# EAGLE design MakerstudioTrainingBoard (EAGLE 8.7.1)
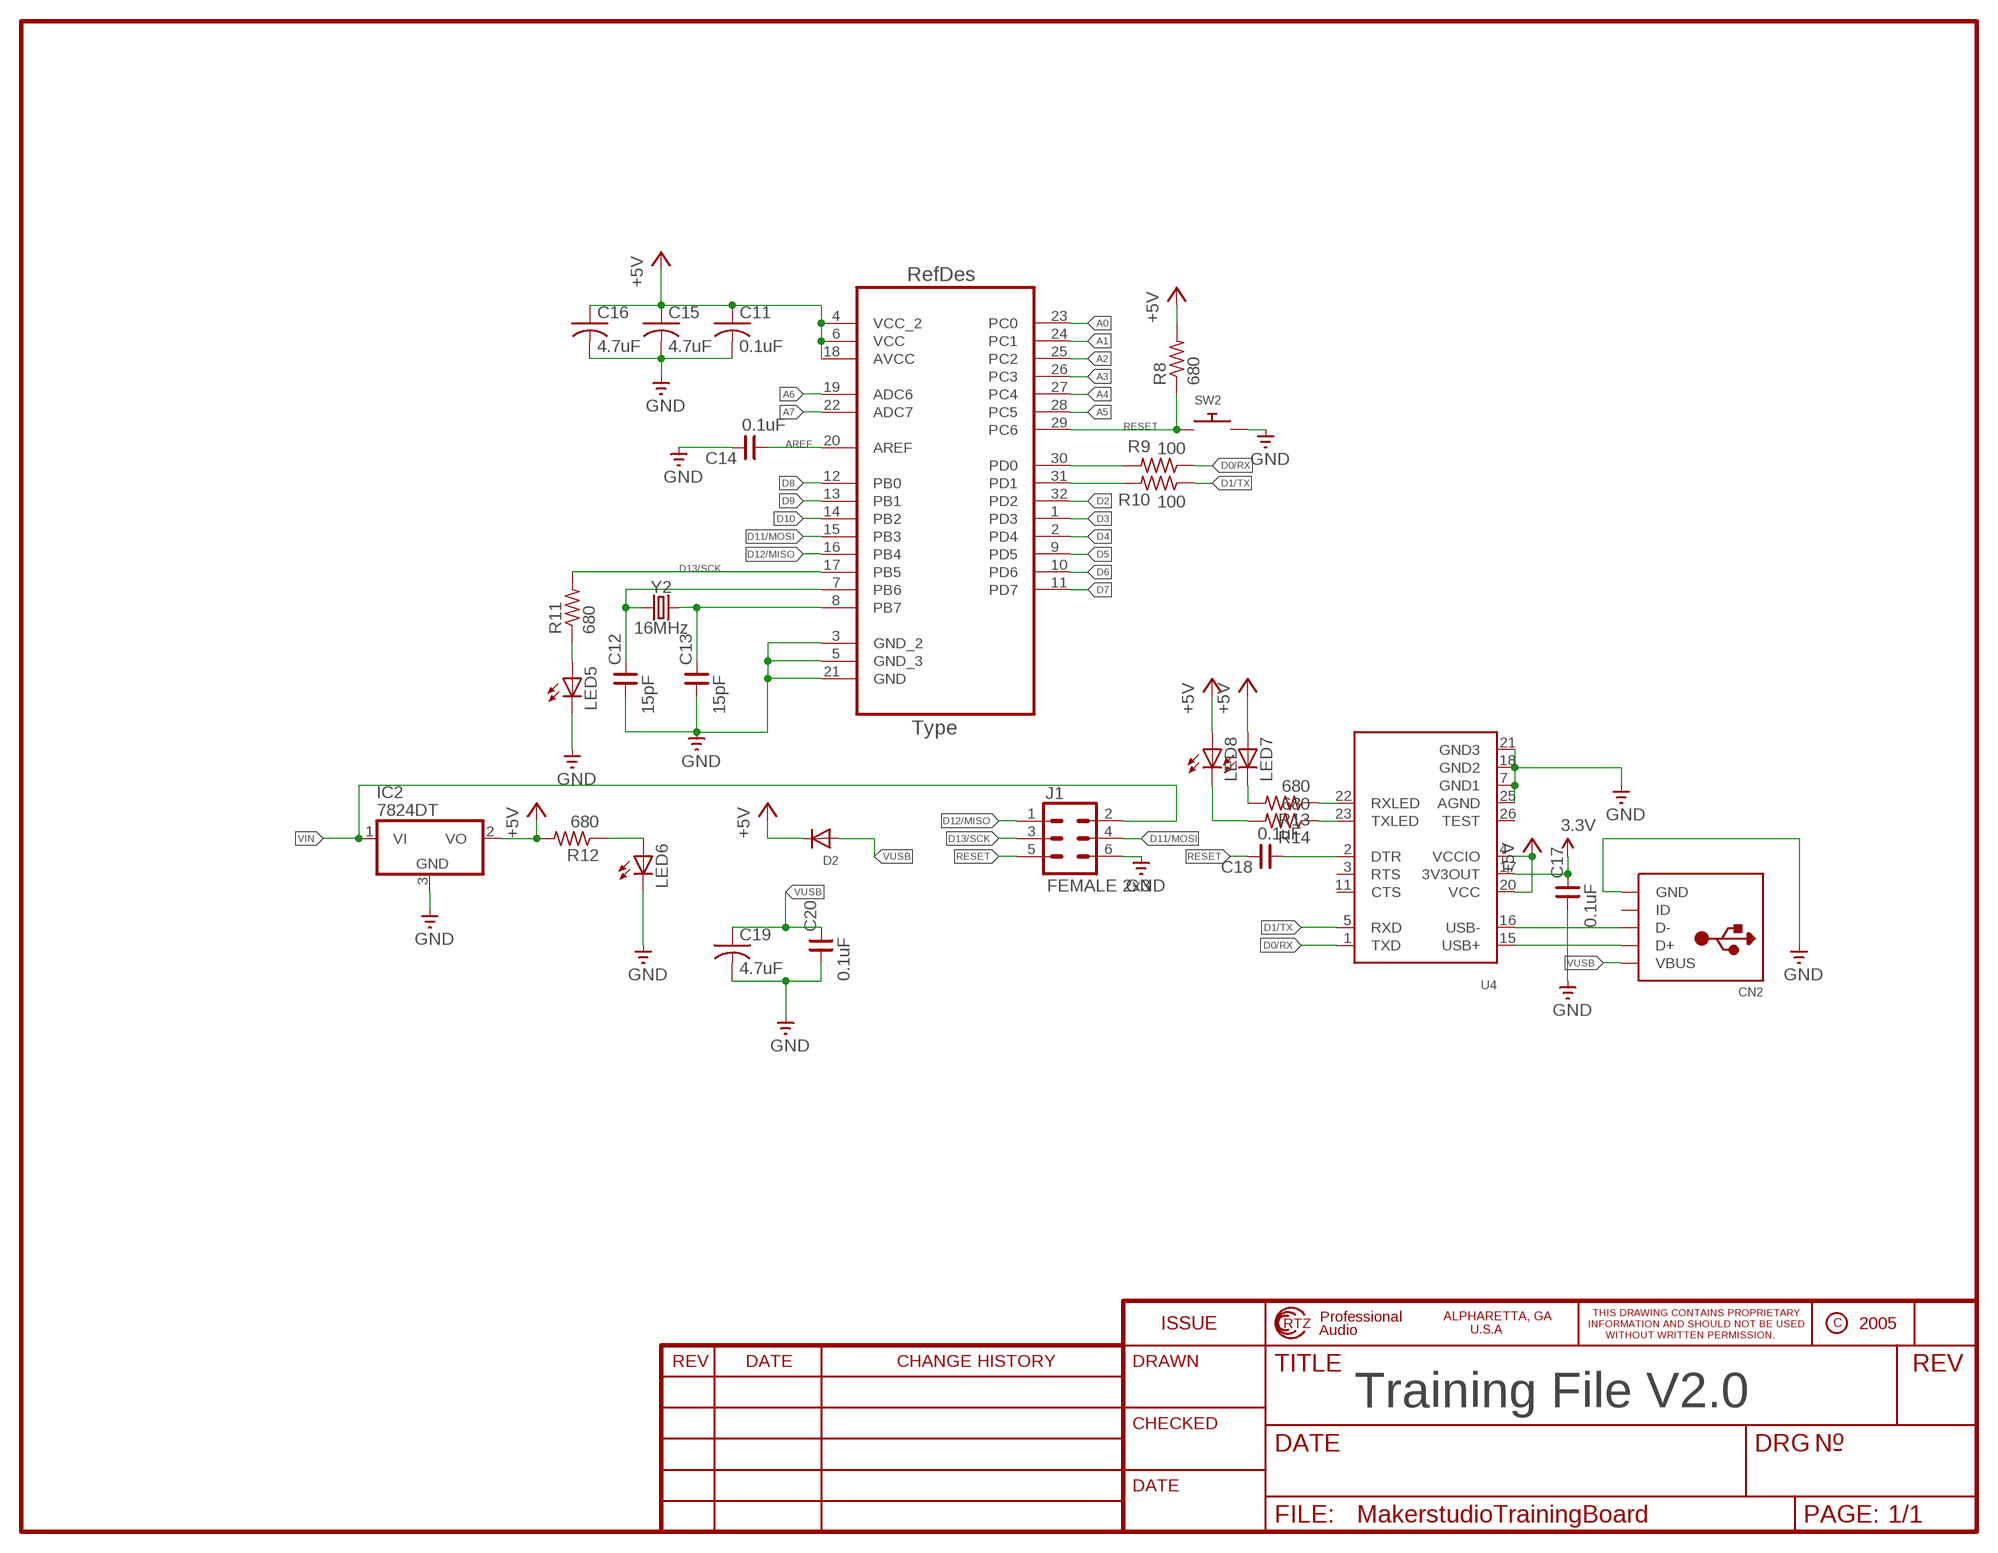
[diagram p0: schematic, sheet 1]

## Parts
C11  0.1uF  C-USC0805  [C0805]
C12  15pF  CNP-0805  [0805]
C13  15pF  CNP-0805  [0805]
C14  0.1uF  CNP-0805  [0805]
C15  4.7uF  C-USC0805  [C0805]
C16  4.7uF  C-USC0805  [C0805]
C17  0.1uF  CNP-0805  [0805]
C18  0.1uF  CNP-0805  [0805]
C19  4.7uF  C-USC0805  [C0805]
C20  0.1uF  CNP-0805  [0805]
CN2  USBMINIB  [USB-MINIB]
D2  DIODESOD-123  [SOD-123]
IC2  7824DT  [TO252]
J1  FEMALE 2x3  CONN_03X2FEMALE  [2X3]
LED5  LEDCHIPLED_0805  [CHIPLED_0805]
LED6  LEDCHIPLED_0805  [CHIPLED_0805]
LED7  LEDCHIPLED_0805  [CHIPLED_0805]
LED8  LEDCHIPLED_0805  [CHIPLED_0805]
R8  680  R-US_R0805  [R0805]
R9  100  R-US_R0805  [R0805]
R10  100  R-US_R0805  [R0805]
R11  680  R-US_R0805  [R0805]
R12  680  R-US_R0805  [R0805]
R13  680  R-US_R0805  [R0805]
R14  680  R-US_R0805  [R0805]
SW2  SWITCH_PUSHBUTTONEVQ-PE  [TACT_PANA-EVQ]
U3  ATMEGA328P-AU  [QFP80P900X900X120-32N]
U4  FT232RLSSOP28  [SSOP28DB]
Y2  16MHz  CRYSTAL-16MHZPTH-HC49US  [HC49US]

## Nets
3.3V: C17.2 U4.17(3V3OUT)
+5V: C11.1 C15.1 C16.1 D2.C IC2.2(VO) LED7.A LED8.A R8.2 R12.2 U3.4(VCC_2) U3.6(VCC) U3.18(AVCC) U4.4(VCCIO) U4.20(VCC)
A0: U3.23(PC0)
A1: U3.24(PC1)
A2: U3.25(PC2)
A3: U3.26(PC3)
A4: U3.27(PC4)
A5: U3.28(PC5)
A6: U3.19(ADC6)
A7: U3.22(ADC7)
AREF: C14.1 U3.20(AREF)
D0/RX: R9.1 U4.1(TXD)
D1/TX: R10.1 U4.5(RXD)
D2: U3.32(PD2)
D3: U3.1(PD3)
D4: U3.2(PD4)
D5: U3.9(PD5)
D6: U3.10(PD6)
D7: U3.11(PD7)
D8: U3.12(PB0)
D9: U3.13(PB1)
D10: U3.14(PB2)
D11/MOSI: J1.4 U3.15(PB3)
D12/MISO: J1.1 U3.16(PB4)
D13/SCK: J1.3 R11.2 U3.17(PB5)
GND: C11.2 C12.1 C13.1 C14.2 C15.2 C16.2 C17.1 C19.2 C20.1 CN2.GND IC2.3(GND) J1.6 LED5.C LED6.C SW2.P$2 U3.3(GND_2) U3.5(GND_3) U3.21(GND) U4.7(GND1) U4.18(GND2) U4.21(GND3) U4.25(AGND)
N$1: LED5.A R11.1
N$112: C13.2 U3.8(PB7) Y2.2
N$113: C12.2 U3.7(PB6) Y2.1
N$114: R9.2 U3.30(PD0)
N$115: R10.2 U3.31(PD1)
N$117: LED6.A R12.1
N$118: CN2.D+ U4.15(USB+)
N$119: CN2.D- U4.16(USB-)
N$120: R13.1 U4.22(RXLED)
N$121: R14.1 U4.23(TXLED)
N$122: LED8.C R14.2
N$123: LED7.C R13.2
N$124: C18.1 U4.2(DTR)
RESET: C18.2 J1.5 R8.1 SW2.P$1 U3.29(PC6)
VIN: IC2.1(VI) J1.2
VUSB: C19.1 C20.2 CN2.VBUS D2.A
Unconnected: CN2.ID U4.3(RTS) U4.11(CTS) U4.26(TEST)

## Notes on the sheet
- Training File V2.0

## Library data of the parts
C11 C15 C16 C19 = adafruit:C-US: CAPACITOR, American symbol
C12-C14 C17 C18 C20 = cap-master:CNP-: NON-POLARIZED CAP
CN2 = adafruit:USB: USB Connectors USBMINIB - Surface Mount Female Mini-B USB Connector 4UConnector: 06564 By microbuilder.eu Thru-hole RA Female Mini-B USB Connector 4UConnector: 18732 By ladyada.net
D2 = adafruit:DIODE: Diode SMADIODE - SMA Surface Mount Package 20V 1A Schottky Diode Digikey: 641-1014-6-ND DO-1N4148 - Through Hole Small Current Diode SOD-123 20V 1 A (.5mV Vf) Schottky Diode - Digikey: MBRX120TPMSCT-ND SOD-323 10V 570mA (.38mV Vf, 3ns) Schottky Diode - Digikey: ZLLS410CT-ND SOD-523 30V 30mA Schottky Diode (RB751S-40TE61) - Digikey: RB751S-40TE61CT-ND SOT23-R/W - SOT23 Package (R = Solder Paste/Reflow Ovens, W = Hand-Soldering) BAT54Film 40V 300mA - Digikey: 497-7162-1-ND
IC2 = adafruit:78*: Positive VOLTAGE REGULATOR Added bigger pads to the TO-92 package
J1 = SparkFun-Connectors:CONN_03X2: Multi connection point. Often used as Generic Header-pin footprint for 0.1 inch spaced/style header connections You can populate with any combo of single row headers, but if you'd like an exact match, check these: Header - 2x3 (Male, 0.1") <https://www.sparkfun.com/products/12807> (PRT-12807) Header - 2x3 (Female, 0.1") <https://www.sparkfun.com/products/13010> (PRT-13010) 2x3 Pin Shrouded Header <https://www.sparkfun.com/products/10877> (PRT-10877) On any of the 0.1 inch spaced packages, you can populate with these: Break Away Headers - Straight <https://www.sparkfun.com/products/116> (PRT-00116) Break Away Male Headers - Right Angle <https://www.sparkfun.com/products/553> (PRT-00553) Female Headers <https://www.sparkfun.com/products/115> (PRT-00115) Break Away Headers - Machine Pin <https://www.sparkfun.com/products/117> (PRT-00117) Break Away Female Headers - Swiss Machine Pin <https://www.sparkfun.com/products/743> (PRT-00743) Special note: the shrouded connector mates well with our 3x2 ribbon cables: Ribbon Crimp Connector - 6-pin (2x3, Female) <https://www.sparkfun.com/products/10651> (PRT-10651) Ribbon Cable - 6 wire (15ft) <https://www.sparkfun.com/products/10646> (PRT-10646); PROD_ID: CONN-11566
LED5-LED8 = adafruit:LED: LED OSRAM: - CHIPLED LG R971, LG N971, LY N971, LG Q971, LY Q971, LO R971, LY R971 LH N974, LH R974 LS Q976, LO Q976, LY Q976 LO Q996 - Hyper CHIPLED LW Q18S LB Q993, LB Q99A, LB R99A - SideLED LS A670, LO A670, LY A670, LG A670, LP A670 LB A673, LV A673, LT A673, LW A673 LH A674 LY A675 LS A676, LA A676, LO A676, LY A676, LW A676 LS A679, LY A679, LG A679 - Hyper Micro SIDELED® LS Y876, LA Y876, LO Y876, LY Y876 LT Y87S - SmartLED LW L88C, LW L88S LB L89C, LB L89S, LG L890 LS L89K, LO L89K, LY L89K LS L896, LA L896, LO L896, LY L896 - TOPLED LS T670, LO T670, LY T670, LG T670, LP T670 LSG T670, LSP T670, LSY T670, LOP T670, LYG T670 LG T671, LOG T671, LSG T671 LB T673, LV T673, LT T673, LW T673 LH T674 LS T676, LA T676, LO T676, LY T676, LB T676, LH T676, LSB T676, LW T676 LB T67C, LV T67C, LT T67C, LS T67K, LO T67K, LY T67K, LW E67C LS E67B, LA E67B, LO E67B, LY E67B, LB E67C, LV E67C, LT E67C LW T67C LS T679, LY T679, LG T679 LS T770, LO T770, LY T770, LG T770, LP T770 LB T773, LV T773, LT T773, LW T773 LH T774 LS E675, LA E675, LY E675, LS T675 LS T776, LA T776, LO T776, LY T776, LB T776 LHGB T686 LT T68C, LB T68C - Hyper Mini TOPLED® LB M676 - Mini TOPLED Santana® LG M470 LS M47K, LO M47K, LY M47K Source: http://www.osram.convergy.de/
R8-R14 = adafruit:R-US_: RESISTOR, American symbol
SW2 = adafruit:SWITCH_PUSHBUTTON: Buttons SOFTTOUCHSMD_SJ - Soft touch temporary push button (Super Junk Akihabara) Compatible with SKPMANE010 [Mouser: 688-SKPMAN] C&K_KSS = Digikey: KSS221GLFS
U3 = Atmel-ATMEGA328P-AU:ATMEGA328P-AU; DESCRIPTION: 8-bit Microcontroller with In-System Programmable Flash; MPN: ATMEGA328P-AU; OC_FARNELL: 1715486; OC_NEWARK: 14R4631; PACKAGE: TQFP-32; SUPPLIER: Atmel
U4 = microbuilder:FT232RL: FTDI FT232RL USB TO RS232 Converter Digikey: 768-1007-1-ND
Y2 = SparkFun-Clocks:CRYSTAL-16MHZ: 16MHz Crystal Digikey Example <http://www.digikey.com/product-search/en?keywords=535-9122-1-ND> Frequency: 16MHz Frequency Stability: ±50ppm Frequency Tolerance: ±20ppm Load Capacitance: 18pF SparkFun Products: Pro Micro -5V/16MHz <https://www.sparkfun.com/products/12640> SparkFun Serial Enabled LCD Kit <https://www.sparkfun.com/products/10097>; PROD_ID: XTAL-08181; SF_ID: COM-00536

## Net classes
0 default: width 0.305 mm

## Board
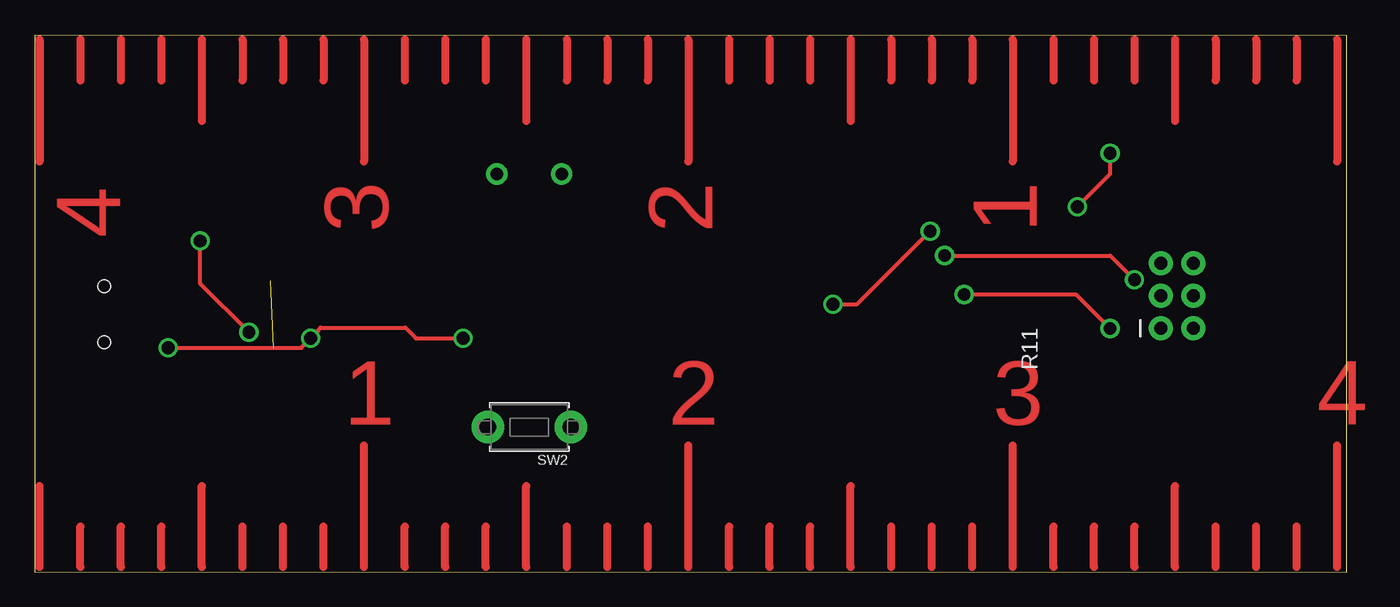
[diagram p1: board, top side]
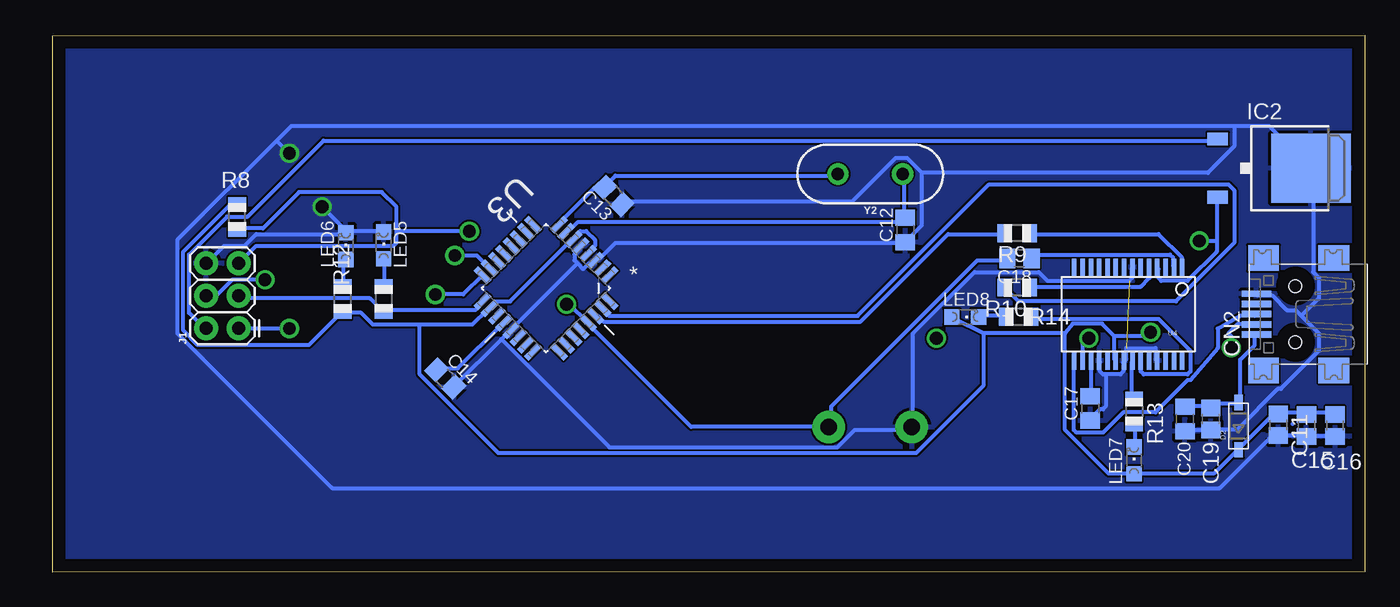
[diagram p2: board, bottom side, seen from below]

Size 102.72 x 42.02 mm. Coordinates in mm from the lower left corner, seen from the top.
Outline: 0,0.03 102.72,0 102.72,41.99 0,42.02 0,0.03
Copper layers (1*16): Top 0.035mm / dielectric 1.5mm / Bottom 0.035mm
Design rules "default": minimum track width 6mil, minimum drill 0.35mm, track to track 6mil, track to pad 6mil, pad to pad 6mil, via to via 6mil, smd to smd 6mil, copper to edge 40mil, drill to drill 6mil, minimum pad ring 10mil, minimum via ring 8mil, stop-mask expansion 4mil, vias tented up to drill 0mil, thermal gap 10mil

### Footprints (pad centres in the part's own frame; a part is rotated, then mirrored left to right if it is on the bottom)
C0805 = smd 1.3 x 1.5: 1 -0.85,0; 2 0.85,0
0805 = smd 1.27 x 1.524: 1 -0.953,0; 2 0.953,0
USB-MINIB = smd 0.5 x 2.308: D+ 0,4.064; D- -0.8,4.064; GND 1.6,4.064; ID 0.8,4.064; VBUS -1.6,4.064 | smd 2 x 2.4: GND1 -4.4,-2; GND2 -4.4,3.5; GND3 4.4,3.5; GND4 4.4,-2 | hole 1: -2.2,1; 2.2,1
SOD-123 = smd 1.2 x 0.7: A 1.85,0; C -1.85,0
TO252 = smd 1 x 1.6: 1 -2.28,-4.8; 2 2.28,-4.8 | smd 5.4 x 6.2: 3 0,2.5
2X3 = drill 1.016 pad 1.88: 1 0,0; 2 0,2.54; 3 2.54,0; 4 2.54,2.54; 5 5.08,0; 6 5.08,2.54
CHIPLED_0805 = smd 1.2 x 1.2: A 0,-1.05; C 0,1.05
R0805 = smd 1.1 x 1.4: 1 -1,0; 2 1,0
TACT_PANA-EVQ = drill 1.3 pad 2.54: P$1 -3.25,0; P$2 3.25,0
QFP80P900X900X120-32N = smd 1.473 x 0.508: 1 -4.242,2.794; 2 -4.242,2.007; 3 -4.242,1.194; 4 -4.242,0.406; 5 -4.242,-0.406; 6 -4.242,-1.194; 7 -4.242,-2.007; 8 -4.242,-2.794; 17 4.242,-2.794; 18 4.242,-2.007; 19 4.242,-1.194; 20 4.242,-0.406; 21 4.242,0.406; 22 4.242,1.194; 23 4.242,2.007; 24 4.242,2.794 | smd 0.508 x 1.473: 9 -2.794,-4.242; 10 -2.007,-4.242; 11 -1.194,-4.242; 12 -0.406,-4.242; 13 0.406,-4.242; 14 1.194,-4.242; 15 2.007,-4.242; 16 2.794,-4.242; 25 2.794,4.242; 26 2.007,4.242; 27 1.194,4.242; 28 0.406,4.242; 29 -0.406,4.242; 30 -1.194,4.242; 31 -2.007,4.242; 32 -2.794,4.242
SSOP28DB = smd 0.348 x 1.397: 1 -4.225,-3.656; 2 -3.575,-3.656; 3 -2.925,-3.656; 4 -2.275,-3.656; 5 -1.625,-3.656; 6 -0.975,-3.656; 7 -0.325,-3.656; 8 0.325,-3.656; 9 0.975,-3.656; 10 1.625,-3.656; 11 2.275,-3.656; 12 2.925,-3.656; 13 3.575,-3.656; 14 4.225,-3.656; 15 4.225,3.656; 16 3.575,3.656; 17 2.925,3.656; 18 2.275,3.656; 19 1.625,3.656; 20 0.975,3.656; 21 0.325,3.656; 22 -0.325,3.656; 23 -0.975,3.656; 24 -1.625,3.656; 25 -2.275,3.656; 26 -2.925,3.656; 27 -3.575,3.656; 28 -4.225,3.656
HC49US = drill 1 pad 1.651: 1 -2.54,0; 2 2.54,0

### Placement (x,y rotation side)
C11  6.76,11.55 270 bottom
C12  35.96,26.8 90 bottom
C13  58.82,29.46 135 bottom
C14  71.99,15.17 315 bottom
C15  4.55,11.49 270 bottom
C16  2.32,11.49 270 bottom
C17  21.48,12.83 90 bottom
C18  27.03,24.57 180 bottom
C19  12.04,12 270 bottom
C20  14.08,12 90 bottom
CN2  4.41,20.2 90 bottom
D2  9.88,11.44 90 bottom
IC2  6.7,31.63 270 bottom
J1  88.17,19.1 90 bottom
LED5  76.81,25.59 0 bottom
LED6  79.78,25.53 0 bottom
LED7  18.05,8.76 0 bottom
LED8  31.27,19.99 270 bottom
R8  88.29,27.81 90 bottom
R9  27.2,26.54 180 bottom
R10  27.2,22.29 180 bottom
R11  76.81,21.4 270 bottom
R12  80.04,21.39 270 bottom
R13  18.05,12.57 270 bottom
R14  27.08,19.99 180 bottom
SW2  38.71,11.36 180 top
U3  64.1,22.24 225 bottom
U4  18.51,20.2 180 bottom
Y2  38.71,31.18 180 bottom

### Tracks (layer width: path | path; a pad name or v marks a point on that pad's centre or on a via)
3.3V
  Bottom 0.305: U4.17 21.41,16.41 21.41,13.9 C17.2
+5V  (via drill 1)
  Top 0.305: v16.76,18.79 12.95,22.6 v12.95,25.94
  Bottom 0.305: U3.4 60.73,25.1 60.27,25.56 60.27,26.01 60.96,26.7 61.42,26.7 61.87,26.24 U3.6 62.1,26.01 66.9,21.21 68.05,21.21 68.5,20.76 U3.18 68.73,20.53 69.87,19.39 73.99,19.39 | 73.99,19.39 77.65,19.39 78.56,20.3 79.93,20.3 R12.2 80.16,20.3 82.68,17.79 91.36,17.79 92.51,18.93 92.51,25.1 88.85,28.76 88.39,28.76 R8.2 | 29.87,18.7 32.16,19.84 LED8.A | 23.47,18.7 22.86,19.46 20.57,19.46 19.62,18.51 | 23.47,18.7 29.87,18.7 | 19.62,18.51 19.58,18.47 19.58,16.64 U4.20 | C16.1 2.44,12.53 4.5,12.53 C15.1 4.72,12.53 6.55,12.53 C11.1 6.78,12.3 7.24,12.3 9.75,9.78 D2.C 9.98,9.56 11.81,7.73 17.98,7.73 LED7.A 18.21,7.73 20.04,7.73 23.47,11.16 23.47,18.7 | 73.99,19.39 73.99,15.5 67.82,9.33 35.13,9.33 29.87,14.58 29.87,18.7 | 11.58,25.94 11.58,29.22 IC2.2 | 11.58,25.94 11.58,25.1 13.87,22.81 15.93,22.81 16.15,23.04 16.15,23.73 U4.4 | 19.62,18.51 17.04,18.51 v16.76,18.79 | v12.95,25.94 11.58,25.94
AREF
  Bottom 0.305: U3.20 67.59,19.39 71.02,15.96 72.62,15.96 C14.1
D0/RX
  Bottom 0.305: U4.1 14.33,23.96 14.33,24.64 16.15,26.47 25.98,26.47 R9.1
D1/TX
  Bottom 0.305: U4.5 16.84,23.73 16.84,23.04 17.53,22.36 25.98,22.36 R10.1
D11/MOSI  (via drill 1)
  Top 0.305: v71.25,24.8 84.2,24.8 v86.11,22.89
  Bottom 0.305: U3.15 69.5,24.8 v71.25,24.8 | v86.11,22.89 88.68,22.89 89.93,21.64 J1.4
D12/MISO  (via drill 1)
  Top 0.305: v72.77,21.75 81.53,21.75 v84.2,19.08
  Bottom 0.305: U3.16 70.59,21.75 v72.77,21.75 | v84.2,19.08 88.15,19.08 J1.1
D13/SCK
  Bottom 0.305: U3.17 69.19,20.99 69.65,20.53 76.73,20.53 R11.2 76.96,20.53 77.88,21.44 88.16,21.44 J1.3
GND  (via drill 1)  (1 unrouted)
  Top 0.305: v81.62,28.61 84.2,31.18 v84.2,32.8
  Bottom 0.305: U4.25 16.38,16.64 16.38,17.56 18.67,17.56 18.67,16.64 U4.21 18.9,16.41 18.9,15.73 19.13,15.5 20.27,15.5 | 20.27,15.5 20.5,15.5 20.73,15.73 20.73,16.41 U4.18 | 20.27,15.5 20.27,12.98 20.5,12.76 20.73,12.76 21.41,12.07 C17.1 | U4.7 18.21,23.73 18.21,23.04 18.44,22.81 24.84,22.81 25.53,23.5 30.56,23.5 35.36,18.7 35.36,11.38 SW2.P$2 35.58,11.16 39.93,11.16 41.3,9.78 59.13,9.78 67.59,18.24 | 67.59,18.24 71.25,14.58 C14.2 | 67.59,18.24 66.9,18.93 U3.21 66.67,19.16 61.65,24.19 | 61.65,24.19 61.87,24.41 61.87,24.87 61.42,25.33 U3.5 | 61.65,24.19 61.19,23.73 60.73,24.19 60.27,24.19 U3.3 60.05,24.41 58.67,25.79 36.04,25.79 C12.1 35.81,26.01 34.67,27.16 34.67,31.27 | 34.67,31.27 35.81,32.42 36.73,32.42 40.16,28.99 57.99,28.99 C13.1 | C20.1 13.87,11.16 12.27,11.16 C19.2 9.98,11.16 6.78,14.36 6.55,14.36 3.58,17.33 3.58,18.7 4.95,20.07 | 4.95,20.07 5.41,20.53 6.1,20.53 7.24,21.67 8.38,21.67 CN2.GND | C16.2 2.44,10.7 4.5,10.7 C15.2 4.72,10.7 6.55,10.7 C11.2 6.78,10.47 7.47,10.47 11.35,6.58 80.85,6.58 92.96,18.7 92.96,26.01 85.19,33.79 | 85.19,33.79 84.05,34.93 10.21,34.93 | 10.21,34.93 7.47,34.93 4.27,31.73 IC2.3 4.04,31.5 4.04,23.5 3.58,23.04 3.58,21.44 4.95,20.07 | 34.67,31.27 12.27,31.27 10.21,33.33 10.21,34.93 | LED6.C 79.7,26.7 76.96,26.7 LED5.C | LED6.C 79.93,26.47 86.79,26.47 87.71,25.56 89.31,25.56 90.68,24.19 J1.6 | LED6.C 79.78,26.76 v81.62,28.61 | v84.2,32.8 85.19,33.79
  pour Bottom: 0,0.03 0,41.94 102.87,41.94 102.87,0.03
N$1
  Bottom 0.305: LED5.A 76.73,24.41 76.73,22.59 R11.1
N$2
  Bottom 0.305: 5.64,11.61 5.66,11.6
N$4
  Top 0.61: 25.78,0.41 25.78,9.94
N$5
  Top 0.61: 51.18,0.41 51.18,9.94
N$6
  Top 0.61: 38.48,0.41 38.48,6.76
N$7
  Top 0.61: 28.96,0.41 28.96,3.59
N$8
  Top 0.61: 32.13,0.41 32.13,3.59
N$9
  Top 0.61: 35.31,0.41 35.31,3.59
N$10
  Top 0.61: 41.66,0.41 41.66,3.59
N$11
  Top 0.61: 44.83,0.41 44.83,3.59
N$12
  Top 0.61: 48.01,0.41 48.01,3.59
N$13
  Top 0.61: 54.36,0.41 54.36,3.59
N$14
  Top 0.61: 57.53,0.41 57.53,3.59
N$15
  Top 0.61: 60.71,0.41 60.71,3.59
N$16
  Top 0.61: 63.88,0.41 63.88,6.76
N$17
  Top 0.61: 67.06,0.41 67.06,3.59
N$18
  Top 0.61: 70.23,0.41 70.23,3.59
N$19
  Top 0.61: 73.41,0.41 73.41,3.59
N$20
  Top 0.61: 76.58,0.41 76.58,9.94
N$21
  Top 0.61: 79.76,0.41 79.76,3.59
N$22
  Top 0.61: 82.93,0.41 82.93,3.59
N$23
  Top 0.61: 86.11,0.41 86.11,3.59
N$24
  Top 0.61: 89.28,0.41 89.28,6.76
N$25
  Top 0.61: 92.46,0.41 92.46,3.59
N$26
  Top 0.61: 95.63,0.41 95.63,3.59
N$27
  Top 0.61: 98.81,0.41 98.81,3.59
N$28
  Top 0.61: 101.98,0.41 101.98,9.94
N$45
  Top 0.61: 22.61,0.41 22.61,3.59
N$46
  Top 0.61: 19.43,0.41 19.43,3.59
N$47
  Top 0.61: 16.26,0.41 16.26,3.59
N$48
  Top 0.61: 13.08,0.41 13.08,6.76
N$49
  Top 0.61: 9.91,0.41 9.91,3.59
N$50
  Top 0.61: 6.73,0.41 6.73,3.59
N$51
  Top 0.61: 3.56,0.41 3.56,3.59
N$52
  Top 0.61: 0.38,0.41 0.38,6.76
N$53
  Top 0.61: 0.38,41.69 0.38,32.16
N$54
  Top 0.61: 3.56,41.69 3.56,38.51
N$55
  Top 0.61: 6.73,41.69 6.73,38.51
N$56
  Top 0.61: 9.91,41.69 9.91,38.51
N$57
  Top 0.61: 13.08,41.69 13.08,35.34
N$58
  Top 0.61: 16.26,41.69 16.26,38.51
N$59
  Top 0.61: 19.43,41.69 19.43,38.51
N$60
  Top 0.61: 22.61,41.69 22.61,38.51
N$61
  Top 0.61: 25.78,41.69 25.78,32.16
N$62
  Top 0.61: 28.96,41.69 28.96,38.51
N$63
  Top 0.61: 32.13,41.69 32.13,38.51
N$64
  Top 0.61: 35.31,41.69 35.31,38.51
N$65
  Top 0.61: 38.48,41.69 38.48,35.34
N$66
  Top 0.61: 41.66,41.69 41.66,38.51
N$67
  Top 0.61: 44.83,41.69 44.83,38.51
N$68
  Top 0.61: 48.01,41.69 48.01,38.51
N$69
  Top 0.61: 51.18,41.69 51.18,32.16
N$70
  Top 0.61: 54.36,41.69 54.36,38.51
N$71
  Top 0.61: 57.53,41.69 57.53,38.51
N$72
  Top 0.61: 60.71,41.69 60.71,38.51
N$73
  Top 0.61: 63.88,41.69 63.88,35.34
N$74
  Top 0.61: 67.06,41.69 67.06,38.51
N$75
  Top 0.61: 70.23,41.69 70.23,38.51
N$76
  Top 0.61: 73.41,41.69 73.41,38.51
N$77
  Top 0.61: 76.58,41.69 76.58,32.16
N$78
  Top 0.61: 79.76,41.69 79.76,38.51
N$79
  Top 0.61: 82.93,41.69 82.93,38.51
N$80
  Top 0.61: 86.11,41.69 86.11,38.51
N$81
  Top 0.61: 89.28,41.69 89.28,35.34
N$82
  Top 0.61: 92.46,41.69 92.46,38.51
N$83
  Top 0.61: 95.63,41.69 95.63,38.51
N$84
  Top 0.61: 98.81,41.69 98.81,38.51
N$85
  Top 0.61: 101.98,41.69 101.98,32.16
N$112
  Bottom 0.305: U3.8 63.02,27.39 60.27,30.13 59.59,30.13 C13.2 59.36,30.36 58.67,31.04 41.3,31.04 Y2.2
N$113
  Bottom 0.305: U3.7 62.33,26.7 61.65,27.39 36.27,27.39 36.04,27.61 C12.2 36.04,27.84 36.04,31.04 Y2.1
N$114
  Bottom 0.305: R9.2 28.27,26.47 32.61,26.47 39.47,19.61 59.59,19.61 60.05,20.07 U3.30
N$115
  Bottom 0.305: R10.2 28.04,22.13 27.13,21.21 14.78,21.21 10.21,25.79 10.21,29.9 10.67,30.36 29.41,30.36 39.7,20.07 59.13,20.07 59.59,20.53 U3.31
N$117
  Bottom 0.305: LED6.A 79.93,24.41 79.93,22.59 R12.1
N$118
  Bottom 0.305: U4.15 22.78,16.41 22.78,11.16 22.55,10.93 20.5,10.93 18.9,12.53 16.38,12.53 13.87,15.04 13.64,15.04 11.51,17.56 11.51,19.08 9.75,20.07 8.61,20.07 CN2.D+
N$119  (via drill 1)
  Top 0.305: v10.45,17.57 20.85,17.57 v21.6,18.32 22.19,18.92 22.19,18.97 22.37,19.14 29.02,19.14 29.84,18.32 v33.53,18.32
  Bottom 0.305: CN2.D- 9.96,19.4 10.67,18.7 10.45,18.48 v10.45,17.57 | v21.6,18.32 22.09,17.83 U4.16
N$120
  Bottom 0.305: U4.22 18.21,16.41 18.21,13.67 R13.1
N$121
  Bottom 0.305: U4.23 17.53,16.41 17.53,15.73 17.3,15.5 13.87,15.5 13.64,15.73 13.64,17.33 16.15,19.84 25.98,19.84 R14.1
N$122
  Bottom 0.305: LED8.C 30.1,20.07 28.27,20.07 R14.2
N$123
  Bottom 0.305: LED7.C 17.98,10.01 17.98,11.38 R13.2
N$124
  Bottom 0.305: U4.2 15.01,23.96 15.01,24.64 15.24,24.87 25.76,24.87 25.98,24.64 C18.1
RESET  (via drill 1)
  Top 0.305: v62.48,20.99 64.39,20.99 v70.1,26.7
  Bottom 0.305: C18.2 28.04,24.41 30.33,24.41 41.76,12.98 41.76,11.38 SW2.P$1 41.99,11.38 52.73,11.38 60.73,19.39 U3.29 62.28,20.99 v62.48,20.99 | 75.82,26.7 75.82,25.79 76.05,25.56 86.79,25.56 J1.5 | R8.1 88.16,26.93 86.26,26.93 83.44,29.75 76.96,29.75 75.82,28.61 75.82,26.7 | v70.1,26.7 75.82,26.7
VIN
  Bottom 0.305: IC2.1 11.58,33.79 81.53,33.79 87.48,27.84 89.08,27.84 92.05,24.87 92.05,20.3 90.91,19.16 J1.2
VUSB
  Bottom 0.305: C20.2 13.87,12.98 12.27,12.98 C19.1 12.04,12.98 11.81,13.21 9.98,13.21 D2.A 9.75,13.44 9.75,16.64 8.61,17.79 8.61,18.47 CN2.VBUS

### Text on the board
Top: 4 | 3 | 2 | 1 | 1 | 2 | 3 | 4